# Altium project testTrans.PrjPcb
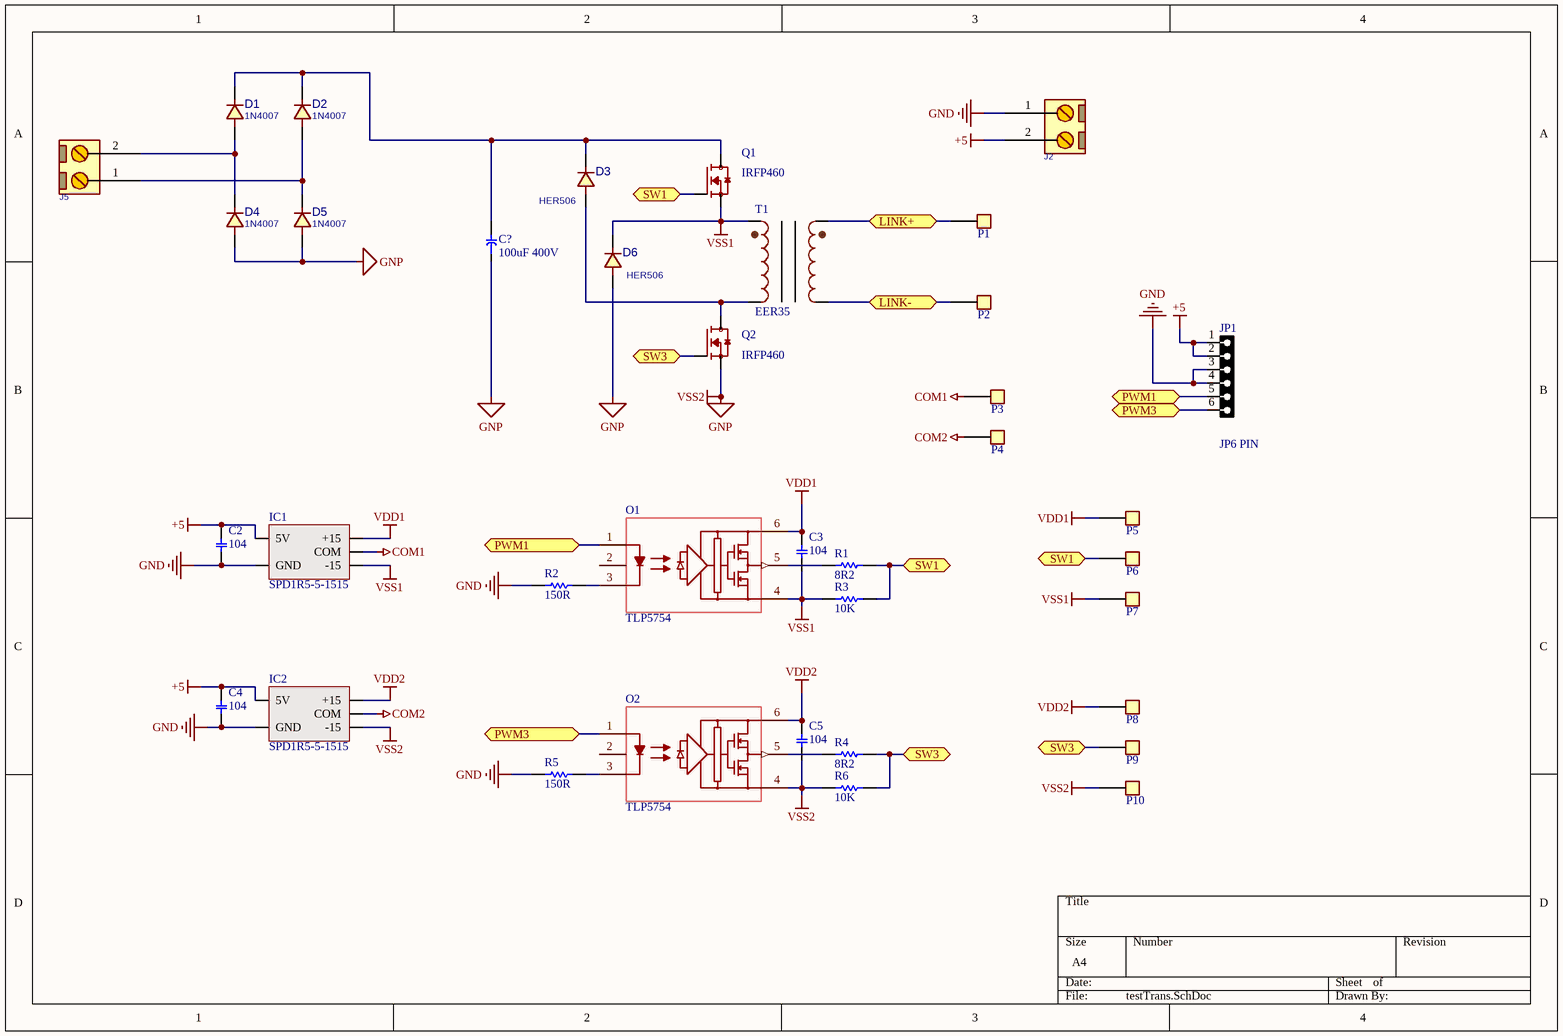
[diagram p0: testTrans.SchDoc]
1 sheet, 37 parts. Net scope: flat (ports and power ports of the same name join across sheets).
Board file: testTrans.PcbDoc

## Sheet testTrans.SchDoc
size A4; SheetNumber: 1; SheetTotal: 1

### Parts
C2  104  [CAP 104]
C3  104  [CAP 104]
C4  104  [CAP 104]
C5  104  [CAP 104]
C?  100uF 400V  [CAP DxL 18x30]
D1  value 1N4007  [DIODE DO-201AD]  (hidden comment: DIODE DIP)
D2  value 1N4007  [DIODE DO-201AD]  (hidden comment: DIODE DIP)
D3  value HER506  [DIODE DO-201AD]  (hidden comment: DIODE DIP)
D4  value 1N4007  [DIODE DO-201AD]  (hidden comment: DIODE DIP)
D5  value 1N4007  [DIODE DO-201AD]  (hidden comment: DIODE DIP)
D6  value HER506  [DIODE DO-201AD]  (hidden comment: DIODE DIP)
IC1  SPD1R5-5-1515  [SPS1R5]
IC2  SPD1R5-5-1515  [SPS1R5]
J2  CONN_TB2  [TBG_2]  (value not drawn)
J5  CONN_TB2  [TBG_2]  (value not drawn)
JP1  JP6 PIN  [JP_6PIN]
O1  TLP5754  [TLP5754]
O2  TLP5754  [TLP5754]
P1  test PCB  [tp_red_1p]  (value not drawn)
P2  test PCB  [Tp_black_1p]  (value not drawn)
P3  test PCB  [tp_white_1p]  (value not drawn)
P4  test PCB  [tp_white_1p]  (value not drawn)
P5  test PCB  [tp_red_1p]  (value not drawn)
P6  test PCB  [tp_white_1p]  (value not drawn)
P7  test PCB  [Tp_black_1p]  (value not drawn)
P8  test PCB  [tp_red_1p]  (value not drawn)
P9  test PCB  [tp_white_1p]  (value not drawn)
P10  test PCB  [Tp_black_1p]  (value not drawn)
Q1  IRFP460  [TO-247]
Q2  IRFP460  [TO-247]
R1  8R2  [R-1W]
R2  150R  [R1/8W]
R3  10K  [R1/8W]
R4  8R2  [R-1W]
R5  150R  [R1/8W]
R6  10K  [R1/8W]
T1  EER35  [Pulse Transformer]

### Ports
LINK+ (bidir), LINK- (bidir), PWM1 (bidir), PWM3 (bidir), SW1 (bidir), SW3 (bidir)

### Nets
+5: C2.2 C4.2 IC1.1(5V) IC2.1(5V) J2.2 JP1.1 JP1.2
COM1: IC1.4(COM) P3.1
COM2: IC2.4(COM) P4.1
GND: C2.1 C4.1 IC1.2(GND) IC2.2(GND) J2.1 JP1.3 JP1.4 R2.1 R5.1
GNP: C5.1 C?.2 D4.1 D5.1 D6.1 IC2.3(-15) O2.4(GND) P10.1 Q2.3(S) R6.1  [also labelled VSS2]
VDD1: C3.2 IC1.5(+15) O1.6(VCC) P5.1
VDD2: C5.2 IC2.5(+15) O2.6(VCC) P8.1
VSS1: C3.1 D6.2 IC1.3(-15) O1.4(GND) P7.1 Q1.3(S) R3.1 T1.2
NetC?_1: C?.1 D1.2 D2.2 D3.2 Q1.2(D)
NetD1_1: D1.1 D4.2 J5.2
NetD2_1: D2.1 D5.2 J5.1
NetD3_1: D3.1 Q2.2(D) T1.3
NetJP1_5: JP1.5 O1.1(NC) ; port PWM1
NetJP1_6: JP1.6 O2.1(NC) ; port PWM3
NetO1_3: O1.3(KATHODE) R2.2
NetO1_5: O1.5(VO) R1.1
NetO2_3: O2.3(KATHODE) R5.2
NetO2_5: O2.5(VO) R4.1
NetP1_1: P1.1 T1.9 ; port LINK+
NetP2_1: P2.1 T1.13 ; port LINK-
NetP6_1: P6.1 Q1.1(G) R1.2 R3.2 ; port SW1
NetP9_1: P9.1 Q2.1(G) R4.2 R6.2 ; port SW3

Not connected (* = marked no-connect by the designer): O1 2(ANODE); O2 2(ANODE)

### Library data of the parts
C2-C5 = CAP Keo: Value: 0,047uF; Copyright: VanDungEvn
C? = CAP DIP
D1-D6 = DIODE DIP: MANF: Kingtronics; DESC: DESCRIPTION; PARAM: 1000V VRRM; PARAM2: 1A; MANF_P#: M7; ASSEMBLY: ASSEMBLY; PRICE: PRICE
IC1 IC2 = SPD1R5-5-1515: Power supply Driver SPD1R5-5-1515 / Efficiency 80% / Input 0.381A / Output 50mA
J2 J5 = CONN_TB2: CONN, TERMINAL BLOCK, 5.08mm pitch; VALUE: CONN_TB2
JP1 = JP6: Value: JP7
O1 O2 = TLP5754: MF: Toshiba Semiconductor; MP: TLP250; Purchase-URL: https://pricing.snapeda.com/search/part/TLP250/?ref=eda; SnapEDA_Link: https://www.snapeda.com/parts/TLP250/Toshiba+Semiconductor+and+Storage/view-part/?ref=snap; Value: *; Package: DIP-8 Toshiba; Availability: In Stock; Price: None; Check_prices: https://www.snapeda.com/parts/TLP250/Toshiba+Semiconductor+and+Storage/view-part/?ref=eda
P1-P10 = test PCB: testpin
Q1 Q2 = MOSFET IRFP460: MOSFET N-Channel 500 V 20A (Tc) 280W (Tc) Through Hole TO-247AC; MF: Vishay Siliconix; SnapEDA_Link: https://www.snapeda.com/parts/IRFP460/Vishay+Siliconix/view-part/?ref=snap; Package: TO-247 Vishay Siliconix; MP: IRFP460; Check_prices: https://www.snapeda.com/parts/IRFP460/Vishay+Siliconix/view-part/?ref=eda; Purchase-URL: https://pricing.snapeda.com/search/part/IRFP460/?ref=eda; Price: None; Value: *; Availability: In Stock
R1-R6 = RES DIP: Value: R1/4W - 1K
T1 = Pulse Transformer